# EAGLE design 8iSwitchesOK (EAGLE 6.6.0)
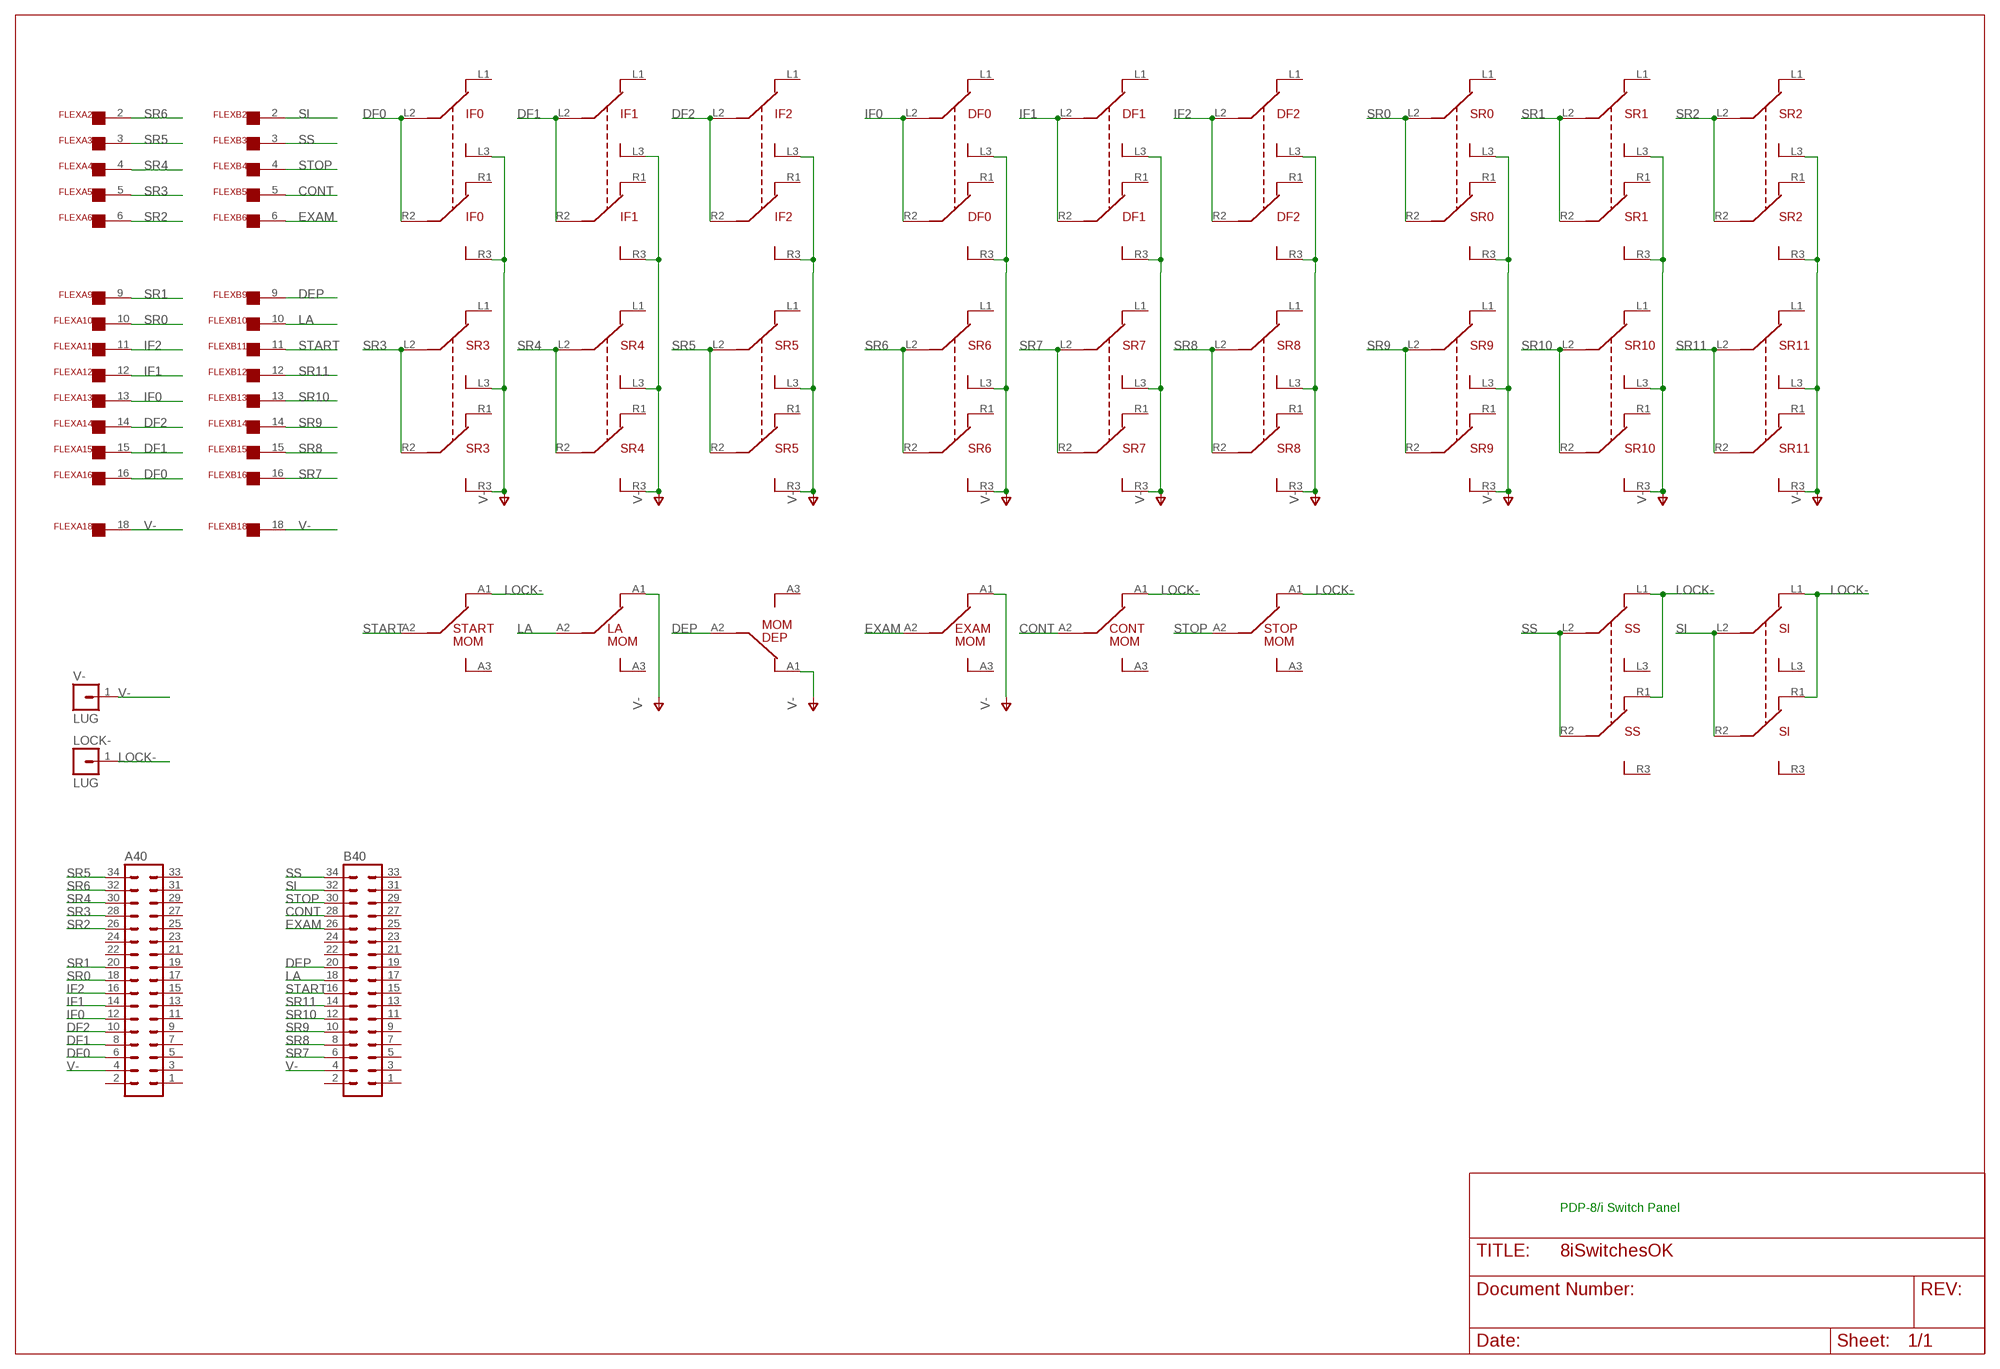
[diagram p0: schematic, sheet 1]

## Parts
A40  MA17-2  [MA17-2]
B40  MA17-2  [MA17-2]
CONT  SPDT8I  [SPDT8I]
DEP  SPDT8I  [SPDT8I]
DF0  DPDT8I  [DPDT8I]
DF1  DPDT8I  [DPDT8I]
DF2  DPDT8I  [DPDT8I]
EXAM  SPDT8I  [SPDT8I]
FLEXA  FLEX19  [FLEX19]
FLEXB  FLEX19  [FLEX19]
IF0  DPDT8I  [DPDT8I]
IF1  DPDT8I  [DPDT8I]
IF2  DPDT8I  [DPDT8I]
LA  SPDT8I  [SPDT8I]
LOCK-  LUG  [SPADELUG]
SI  DPDT8I  [DPDT8I]
SR0  DPDT8I  [DPDT8I]
SR1  DPDT8I  [DPDT8I]
SR2  DPDT8I  [DPDT8I]
SR3  DPDT8I  [DPDT8I]
SR4  DPDT8I  [DPDT8I]
SR5  DPDT8I  [DPDT8I]
SR6  DPDT8I  [DPDT8I]
SR7  DPDT8I  [DPDT8I]
SR8  DPDT8I  [DPDT8I]
SR9  DPDT8I  [DPDT8I]
SR10  DPDT8I  [DPDT8I]
SR11  DPDT8I  [DPDT8I]
SS  DPDT8I  [DPDT8I]
START  SPDT8I  [SPDT8I]
STOP  SPDT8I  [SPDT8I]
V-  LUG  [SPADELUG]

## Nets
CONT: B40.28 CONT.A2 FLEXB.5
DEP: B40.20 DEP.A2 FLEXB.9
DF0: A40.6 FLEXA.16 IF0.L2(A2) IF0.R2(B2)
DF1: A40.8 FLEXA.15 IF1.L2(A2) IF1.R2(B2)
DF2: A40.10 FLEXA.14 IF2.L2(A2) IF2.R2(B2)
EXAM: B40.26 EXAM.A2 FLEXB.6
IF0: A40.12 DF0.L2(A2) DF0.R2(B2) FLEXA.13
IF1: A40.14 DF1.L2(A2) DF1.R2(B2) FLEXA.12
IF2: A40.16 DF2.L2(A2) DF2.R2(B2) FLEXA.11
LA: B40.18 FLEXB.10 LA.A2
LOCK- [supply]: CONT.A1 LOCK-.1 SI.L1(A1) SI.R1(B1) SS.L1(A1) SS.R1(B1) START.A1 STOP.A1
SI: B40.32 FLEXB.2 SI.L2(A2) SI.R2(B2)
SR0: A40.18 FLEXA.10 SR0.L2(A2) SR0.R2(B2)
SR1: A40.20 FLEXA.9 SR1.L2(A2) SR1.R2(B2)
SR2: A40.26 FLEXA.6 SR2.L2(A2) SR2.R2(B2)
SR3: A40.28 FLEXA.5 SR3.L2(A2) SR3.R2(B2)
SR4: A40.30 FLEXA.4 SR4.L2(A2) SR4.R2(B2)
SR5: A40.34 FLEXA.3 SR5.L2(A2) SR5.R2(B2)
SR6: A40.32 FLEXA.2 SR6.L2(A2) SR6.R2(B2)
SR7: B40.6 FLEXB.16 SR7.L2(A2) SR7.R2(B2)
SR8: B40.8 FLEXB.15 SR8.L2(A2) SR8.R2(B2)
SR9: B40.10 FLEXB.14 SR9.L2(A2) SR9.R2(B2)
SR10: B40.12 FLEXB.13 SR10.L2(A2) SR10.R2(B2)
SR11: B40.14 FLEXB.12 SR11.L2(A2) SR11.R2(B2)
SS: B40.34 FLEXB.3 SS.L2(A2) SS.R2(B2)
START: B40.16 FLEXB.11 START.A2
STOP: B40.30 FLEXB.4 STOP.A2
V- [supply]: A40.4 B40.4 DEP.A1 DF0.L3(A3) DF0.R3(B3) DF1.L3(A3) DF1.R3(B3) DF2.L3(A3) DF2.R3(B3) EXAM.A1 FLEXA.18 FLEXB.18 IF0.L3(A3) IF0.R3(B3) IF1.L3(A3) IF1.R3(B3) IF2.L3(A3) IF2.R3(B3) LA.A1 SR0.L3(A3) SR0.R3(B3) SR1.L3(A3) SR1.R3(B3) SR2.L3(A3) SR2.R3(B3) SR3.L3(A3) SR3.R3(B3) SR4.L3(A3) SR4.R3(B3) SR5.L3(A3) SR5.R3(B3) SR6.L3(A3) SR6.R3(B3) SR7.L3(A3) SR7.R3(B3) SR8.L3(A3) SR8.R3(B3) SR9.L3(A3) SR9.R3(B3) SR10.L3(A3) SR10.R3(B3) SR11.L3(A3) SR11.R3(B3) V-.1
Unconnected: A40.1 A40.2 A40.3 A40.5 A40.7 A40.9 A40.11 A40.13 A40.15 A40.17 A40.19 A40.21 A40.22 A40.23 A40.24 A40.25 A40.27 A40.29 A40.31 A40.33 B40.1 B40.2 B40.3 B40.5 B40.7 B40.9 B40.11 B40.13 B40.15 B40.17 B40.19 B40.21 B40.22 B40.23 B40.24 B40.25 B40.27 B40.29 B40.31 B40.33 CONT.A3 DEP.A3 DF0.L1(A1) DF0.R1(B1) DF1.L1(A1) DF1.R1(B1) DF2.L1(A1) DF2.R1(B1) EXAM.A3 FLEXA.1 FLEXA.7 FLEXA.8 FLEXA.17 FLEXA.19 FLEXB.1 FLEXB.7 FLEXB.8 FLEXB.17 FLEXB.19 IF0.L1(A1) IF0.R1(B1) IF1.L1(A1) IF1.R1(B1) IF2.L1(A1) IF2.R1(B1) LA.A3 SI.L3(A3) SI.R3(B3) SR0.L1(A1) SR0.R1(B1) SR1.L1(A1) SR1.R1(B1) SR2.L1(A1) SR2.R1(B1) SR3.L1(A1) SR3.R1(B1) SR4.L1(A1) SR4.R1(B1) SR5.L1(A1) SR5.R1(B1) SR6.L1(A1) SR6.R1(B1) SR7.L1(A1) SR7.R1(B1) SR8.L1(A1) SR8.R1(B1) SR9.L1(A1) SR9.R1(B1) SR10.L1(A1) SR10.R1(B1) SR11.L1(A1) SR11.R1(B1) SS.L3(A3) SS.R3(B3) START.A3 STOP.A3

## Notes on the sheet
- PDP-8/i Switch Panel

## Library data of the parts
A40 B40 = con-lstb:MA17-2: PIN HEADER; OC_FARNELL: unknown; OC_NEWARK: unknown
CONT DEP EXAM LA START STOP = dec-con:SPDT8I: SPDT Momentary, as used in 8/i.
DF0 DF1 DF2 IF0 IF1 IF2 SI SR0 SR1-SR11 SS = dec-con:DPDT8I: DPDT switch as used in 8/i.
FLEXA FLEXB = dec-con:FLEX19: 19 pin Flexprint Connection
LOCK- V- = dec-con:LUG: Spade Lug

## Net classes
1 supply: width 0.762 mm

## Board
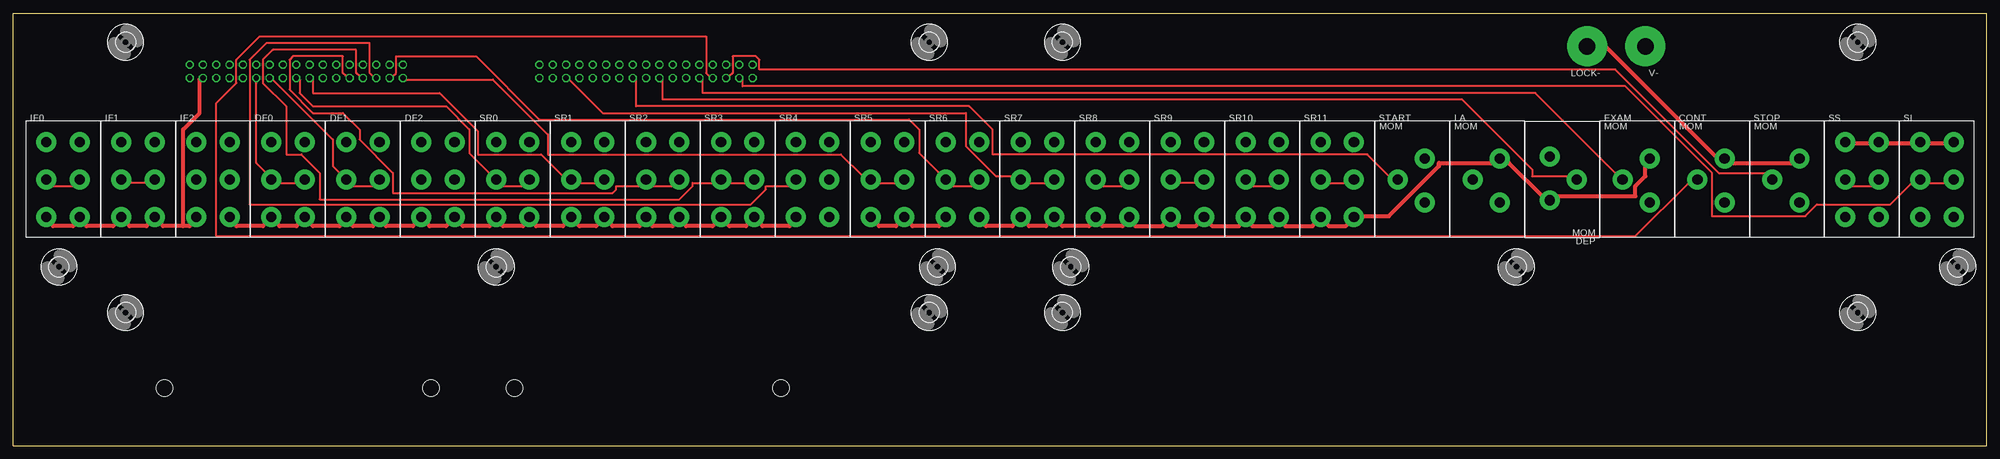
[diagram p1: board, top side]
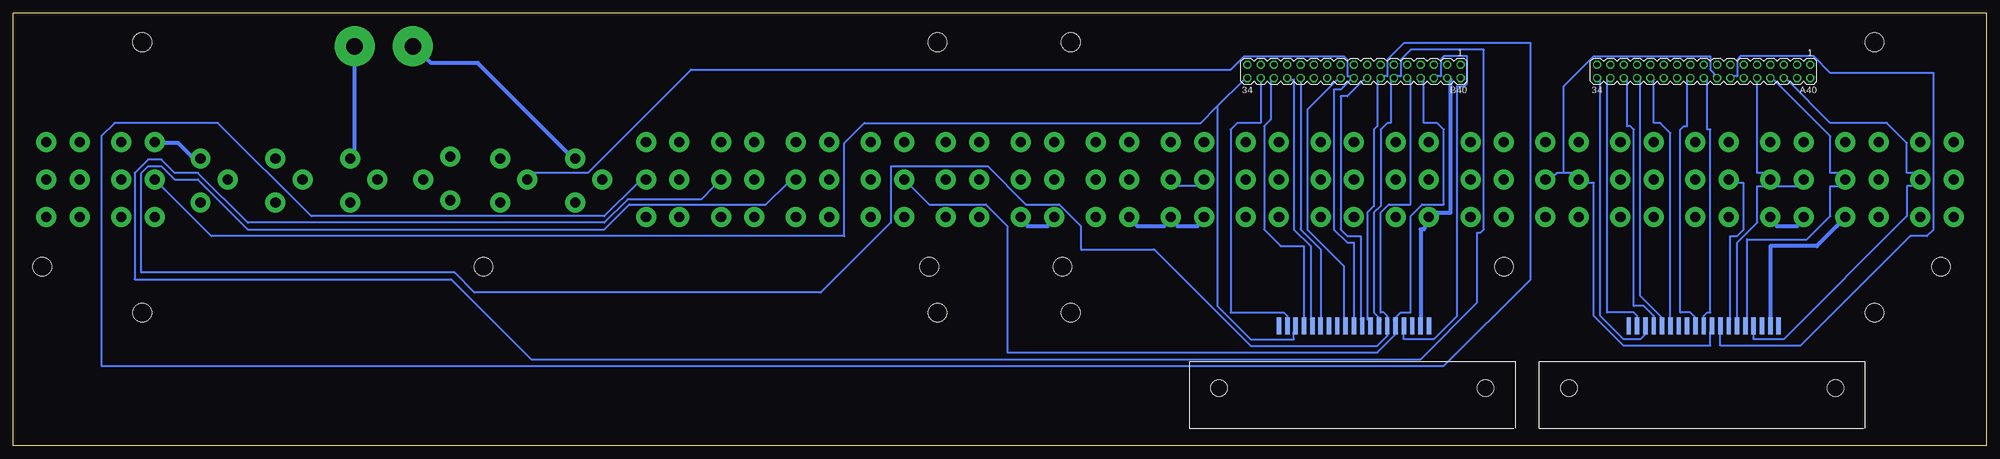
[diagram p2: board, bottom side, seen from below]

Size 376.24 x 82.55 mm. Coordinates in mm from the lower left corner, seen from the top.
Outline: 0,0 101.6,0 376.24,0 376.24,82.55 0,82.55 0,0
Copper layers (1*16): Top 0.035mm / dielectric 1.5mm / Bottom 0.035mm
Design rules "15mils": minimum track width 15mil, minimum drill 24mil, track to track 15mil, track to pad 10mil, pad to pad 10mil, via to via 10mil, smd to smd 10mil, copper to edge 25mil, drill to drill 10mil, minimum pad ring 10mil, minimum via ring 8mil, stop-mask expansion 0mil, vias tented up to drill 0mil, thermal gap 10mil

### Footprints (pad centres in the part's own frame; a part is rotated, then mirrored left to right if it is on the bottom)
MA17-2 = drill 1.016 octagon: 1 -20.32,-1.27; 2 -20.32,1.27; 3 -17.78,-1.27; 4 -17.78,1.27; 5 -15.24,-1.27; 6 -15.24,1.27; 7 -12.7,-1.27; 8 -12.7,1.27; 9 -10.16,-1.27; 10 -10.16,1.27; 11 -7.62,-1.27; 12 -7.62,1.27; 13 -5.08,-1.27; 14 -5.08,1.27; 15 -2.54,-1.27; 16 -2.54,1.27; 17 0,-1.27; 18 0,1.27; 19 2.54,-1.27; 20 2.54,1.27; 21 5.08,-1.27; 22 5.08,1.27; 23 7.62,-1.27; 24 7.62,1.27; 25 10.16,-1.27; 26 10.16,1.27; 27 12.7,-1.27; 28 12.7,1.27; 29 15.24,-1.27; 30 15.24,1.27; 31 17.78,-1.27; 32 17.78,1.27; 33 20.32,-1.27; 34 20.32,1.27
SPDT8I = drill 1.93 pad 3.81: A1 2.381,3.969; A2 -2.778,0; A3 2.381,-4.366
DPDT8I = drill 1.93 pad 3.81: L1 -3.175,7.144; L2 -3.175,0; L3 -3.175,-7.144; R1 3.175,7.144; R2 3.175,0; R3 3.175,-7.144
FLEX19 = smd 3.175 x 0.838: 1 0,14.287; 2 0,12.7; 3 0,11.113; 4 0,9.525; 5 0,7.938; 6 0,6.35; 7 0,4.763; 8 0,3.175; 9 0,1.587; 10 0,0; 11 0,-1.587; 12 0,-3.175; 13 0,-4.763; 14 0,-6.35; 15 0,-7.938; 16 0,-9.525; 17 0,-11.113; 18 0,-12.7; 19 0,-14.287
SPADELUG = drill 3.175 pad 7.62: 1 0,0
3,6 = hole 3.6: 0,0
STRAIN-RELIEF = hole 3.175: 7.62,56.515; 7.62,5.715

### Placement (x,y rotation side)
A40  53.98,71.44 180 bottom
B40  120.65,71.44 180 bottom
CONT  323.85,50.8 0 top
DEP  295.27,50.8 180 top
DF0  52.39,50.8 0 top
DF1  66.67,50.8 0 top
DF2  80.96,50.8 0 top
EXAM  309.56,50.8 0 top
FLEXA  53.98,22.86 90 bottom
FLEXB  120.65,22.86 90 bottom
IF0  9.53,50.8 0 top
IF1  23.81,50.8 0 top
IF2  38.1,50.8 0 top
LA  280.99,50.8 0 top
LOCK-  300.04,76.2 180 top
SI  366.71,50.8 0 top
SR0  95.25,50.8 0 top
SR1  109.54,50.8 0 top
SR2  123.83,50.8 0 top
SR3  138.11,50.8 0 top
SR4  152.4,50.8 0 top
SR5  166.69,50.8 0 top
SR6  180.97,50.8 0 top
SR7  195.26,50.8 0 top
SR8  209.55,50.8 0 top
SR9  223.84,50.8 0 top
SR10  238.12,50.8 0 top
SR11  252.41,50.8 0 top
SS  352.43,50.8 0 top
START  266.7,50.8 0 top
STOP  338.14,50.8 0 top
U$1  [3,6]  201.61,34.13 0 top
U$2  [3,6]  200.03,25.4 0 top
U$3  [3,6]  286.54,34.13 0 top
U$4  [3,6]  200.03,76.99 0 top
U$5  [3,6]  351.63,76.99 0 top
U$6  [3,6]  370.68,34.13 0 top
U$7  [3,6]  351.63,25.4 0 top
U$10  [3,6]  176.21,34.13 0 top
U$11  [3,6]  174.62,25.4 0 top
U$12  [3,6]  174.62,76.99 0 top
U$13  [3,6]  21.43,76.99 0 top
U$14  [3,6]  21.43,25.4 0 top
U$15  [3,6]  8.73,34.13 0 top
U$16  [3,6]  92.08,34.13 0 top
U$17  [STRAIN-RELIEF]  89.85,3.33 90 bottom
U$18  [STRAIN-RELIEF]  23.18,3.33 90 bottom
V-  311.15,76.2 180 top

### Tracks (layer width: path | path; a pad name or v marks a point on that pad's centre or on a via)
CONT
  Top 0.381: CONT.A2 319.4,50.16 309.25,40.01 38.73,40.01 38.73,65.41 42.55,69.22 42.55,73.66 46.99,78.11 132.08,78.11 132.08,71.12 132.72,70.48 B40.28
  Bottom 0.381: FLEXB.5 128.91,24.13 128.91,38.1 132.08,41.27 132.08,69.85 132.72,69.85 B40.28
DEP
  Top 0.381: DEP.A2 296.55,51.44 289.56,51.44 289.56,52.7 276.23,66.04 123.83,66.04 123.83,69.85 B40.20
  Bottom 0.381: B40.20 123.83,69.85 129.54,64.14 129.54,41.27 122.56,34.29 122.56,24.13 FLEXB.9
DF0
  Top 0.381: IF0.L2 7.62,49.53 11.43,49.53 IF0.R2
  Bottom 0.381: A40.6 38.1,69.85 29.84,61.59 19.05,61.59 15.24,57.78 15.24,52.07 13.97,52.07 IF0.R2 13.97,49.53 15.24,49.53 15.24,43.81 38.73,20.32 44.45,20.32 44.45,21.59 FLEXA.16
DF1
  Top 0.381: IF1.L2 22.23,50.16 25.4,50.16 IF1.R2
  Bottom 0.381: A40.8 40.64,69.85 29.84,59.05 29.84,52.07 27.94,52.07 IF1.R2 27.94,49.53 29.84,49.53 29.84,43.81 34.29,39.37 45.72,39.37 45.72,24.13 FLEXA.15
DF2
  Bottom 0.381: A40.10 43.81,69.85 43.81,52.07 42.55,52.07 IF2.R2 | FLEXA.14 47.62,24.13 47.62,38.73 43.81,42.55 43.81,49.53 42.55,49.53 IF2.R2 | IF2.L2 36.2,49.53 40.01,49.53 IF2.R2
EXAM
  Top 0.381: EXAM.A2 305.44,52.07 290.19,67.31 131.44,67.31 131.44,69.85 B40.26
  Bottom 0.381: FLEXB.6 127,24.13 127,37.47 130.81,41.27 130.81,69.85 B40.26
IF0
  Top 0.381: A40.12 46.35,69.85 46.35,53.98 48.26,52.07 DF0.L2 50.8,50.16 53.98,50.16 DF0.R2
  Bottom 0.381: FLEXA.13 48.9,24.13 48.9,40.01 47.62,40.01 46.35,41.27 46.35,50.16 47.62,50.16 DF0.L2
IF1
  Top 0.381: A40.14 49.53,69.85 60.96,58.42 60.96,53.34 62.23,52.07 DF1.L2 64.77,49.53 68.58,49.53 DF1.R2
  Bottom 0.381: FLEXA.12 50.8,21.59 50.8,19.05 35.56,19.05 14.61,40.01 11.43,40.01 10.16,41.27 10.16,71.12 29.84,71.12 33.02,74.3 46.99,74.3 47.62,73.66 47.62,70.48 48.26,70.48 A40.14
IF2
  Bottom 0.381: 80.64,52.07 80.64,68.58 74.93,74.3 52.7,74.3 52.7,71.75 52.07,71.12 52.07,70.48 A40.16 | 80.64,52.07 78.74,52.07 DF2.L2 76.2,50.16 74.93,50.16 74.93,24.77 69.22,19.05 52.7,19.05 52.7,21.59 FLEXA.11 | 80.64,52.07 81.92,52.07 82.55,51.44 DF2.R2
LA
  Bottom 0.381: FLEXB.10 120.65,24.13 120.65,38.73 121.92,38.73 124.46,41.27 124.46,67.94 123.19,67.94 121.28,69.85 B40.18 121.28,70.48 121.92,70.48 121.92,73.66 122.56,74.3 141.6,74.3 144.15,71.75 247.01,71.75 266.7,52.07 276.86,52.07 LA.A2
LOCK-
  Top 0.762: STOP.A1 339.09,53.98 327.66,53.98 CONT.A1 324.49,55.24 303.53,76.2 LOCK-.1 | SS.L1 350.52,57.78 354.33,57.78 SS.R1 356.87,57.78 361.95,57.78 SI.L1 365.12,57.78 368.3,57.78 SI.R1
  Bottom 0.762: STOP.A1 342.26,55.24 344.81,57.78 347.98,57.78 SS.L1 | START.A1 270.51,55.88 287.65,73.03 296.55,73.03 LOCK-.1
SI
  Top 0.381: SI.R2 368.3,50.16 365.12,50.16 SI.L2 361.95,50.16 357.82,46.04 343.85,46.04 342.9,45.09 341.63,43.81 323.85,43.81 323.85,52.07 307.34,68.58 139.06,68.58 139.06,69.85 B40.32
  Bottom 0.381: B40.32 138.43,69.85 138.43,61.59 142.88,61.59 144.15,60.33 144.15,25.4 133.99,25.4 133.35,24.77 133.35,24.13 FLEXB.2
SR0
  Top 0.381: SR0.R2 97.16,49.53 93.34,49.53 SR0.L2 90.81,52.07 87,55.88 87,60.33 82.55,64.77 57.15,64.77 54.61,67.31 54.61,69.85 A40.18
  Bottom 0.381: A40.18 53.34,69.85 53.34,60.33 52.7,60.33 52.7,25.4 53.34,25.4 53.98,24.77 53.98,24.13 FLEXA.10
SR1
  Top 0.381: SR1.R2 111.12,50.16 107.95,50.16 SR1.L2 104.78,51.44 100.65,55.56 88.58,55.56 88.58,60.01 81.28,67.31 57.15,67.31 57.15,69.85 A40.20
  Bottom 0.381: A40.20 57.15,69.85 57.15,60.96 57.78,60.96 58.42,60.33 58.42,25.4 56.52,25.4 55.24,24.13 FLEXA.9
SR2
  Top 0.381: SR2.R2 125.73,49.53 121.92,49.53 SR2.L2 119.38,49.53 114.94,49.53 114.94,48.9 114.3,48.26 72.39,48.26 72.39,52.07 66.04,58.42 66.04,60.33 62.87,63.5 57.15,63.5 52.7,67.94 52.7,73.66 53.34,74.3 62.87,74.3 62.87,71.12 63.5,70.48 A40.26
  Bottom 0.381: A40.26 63.5,69.85 63.5,61.59 62.23,61.59 60.33,59.69 60.33,24.13 FLEXA.6
SR3
  Top 0.381: SR3.R2 139.7,50.16 136.53,50.16 SR3.L2 133.35,50.16 129.54,50.16 129.54,49.53 127,46.99 58.42,46.99 58.42,52.07 54.93,55.56 52.07,55.56 52.07,64.77 47.62,69.22 47.62,73.66 49.53,75.56 65.41,75.56 65.41,71.12 66.04,70.48 A40.28
  Bottom 0.381: A40.28 66.04,69.85 66.04,28.57 61.59,24.13 FLEXA.5
SR4
  Top 0.381: SR4.L2 147.96,49.53 143.51,49.53 143.51,48.9 140.65,46.04 45.09,46.04 45.09,73.66 48.26,76.83 67.94,76.83 67.94,71.12 68.58,70.48 A40.30
  Bottom 0.381: SR4.L2 150.5,49.53 154.31,49.53 SR4.R2 | A40.30 68.58,69.85 68.58,60.96 67.94,60.96 67.31,60.33 67.31,26.67 65.41,26.67 63.5,24.77 63.5,24.13 FLEXA.4
SR5
  Top 0.381: SR5.R2 168.28,50.16 165.1,50.16 SR5.L2 161.93,51.44 157.8,55.56 101.92,55.56 101.92,59.37 91.44,69.85 74.93,69.85 A40.34
  Bottom 0.381: A40.34 73.66,69.85 73.66,24.77 69.22,20.32 66.04,20.32 64.77,21.59 FLEXA.3
SR6
  Top 0.381: SR6.R2 182.88,49.53 179.07,49.53 SR6.L2 176.53,52.07 172.72,55.88 172.72,60.33 170.81,62.23 100.33,62.23 88.27,74.3 73.03,74.3 73.03,71.12 72.39,70.48 A40.32
  Bottom 0.381: A40.32 72.39,69.85 72.39,25.4 67.31,25.4 66.67,24.77 66.67,24.13 FLEXA.2
SR7
  Top 0.381: SR7.R2 196.85,50.16 193.68,50.16 SR7.L2 190.5,51.44 187.32,51.44 181.61,57.15 181.61,63.5 112.39,63.5 106.05,69.85 B40.6
  Bottom 0.381: FLEXB.16 111.12,21.59 111.12,20.32 105.41,20.32 100.97,24.77 100.97,68.58 99.69,68.58 99.06,69.22 99.06,74.3 103.5,74.3 104.14,73.66 104.14,70.48 104.78,70.48 B40.6
SR8
  Top 0.381: SR8.L2 207.65,49.53 211.46,49.53 SR8.R2
  Bottom 0.381: B40.8 107.31,69.85 107.31,61.59 104.78,61.59 103.5,60.33 103.5,46.04 107.63,46.04 109.86,43.81 109.86,25.4 111.76,25.4 113.03,24.13 FLEXB.15 112.39,21.59 116.2,17.78 186.69,17.78 186.69,41.91 190.82,46.04 201.61,46.04 205.1,49.53 SR8.L2
SR9
  Top 0.381: SR9.L2 222.25,50.16 225.43,50.16 SR9.R2
  Bottom 0.381: B40.10 109.86,69.85 109.86,46.04 113.98,46.04 115.57,44.45 115.57,25.4 114.94,25.4 114.3,24.77 114.3,24.13 FLEXB.14 114.3,21.59 114.3,20.95 116.2,19.05 140.34,19.05 158.75,37.47 172.72,37.47 172.72,41.91 176.85,46.04 183.2,46.04 190.5,53.34 208.91,53.34 208.91,42.55 222.25,29.21 288.29,29.21 292.1,33.02 351.79,33.02 351.79,52.07 350.52,53.34 347.98,53.34 345.44,50.8 341,50.8 331.47,41.27 263.52,41.27 258.76,46.04 232.73,46.04 228.6,50.16 SR9.R2
SR10
  Top 0.381: SR10.L2 236.22,49.53 240.03,49.53 SR10.R2
  Bottom 0.381: FLEXB.13 115.57,24.13 116.84,25.4 116.84,44.45 115.57,45.72 115.57,60.33 114.3,61.59 113.67,61.59 113.67,69.85 B40.12 112.39,70.48 111.76,70.48 111.76,73.66 109.86,75.56 95.89,75.56 95.89,41.27 96.52,40.64 97.16,40.64 97.16,27.3 107.95,16.51 277.5,16.51 292.74,31.75 353.06,31.75 353.06,52.07 350.52,54.61 347.98,54.61 345.44,52.07 341,52.07 331.47,42.55 263.52,42.55 259.08,46.99 245.11,46.99 242.57,49.53 SR10.R2
SR11
  Top 0.381: SR11.L2 250.82,50.16 254,50.16 SR11.R2
  Bottom 0.381: FLEXB.12 117.47,24.13 118.11,24.13 118.11,44.45 116.84,45.72 116.84,60.33 116.2,60.96 116.2,69.85 B40.14 114.94,70.48 114.3,70.48 114.3,73.66 111.12,76.83 87,76.83 87,31.75 103.5,15.24 359.41,15.24 359.41,59.05 356.87,61.59 337.19,61.59 319.4,43.81 263.52,43.81 257.18,50.16 SR11.R2
SS
  Top 0.381: SS.R2 354.33,49.53 350.52,49.53 SS.L2
  Bottom 0.381: 146.69,64.77 149.86,61.59 214,61.59 217.81,57.78 217.81,40.01 338.45,40.01 347.98,49.53 SS.L2 | 146.69,64.77 141.6,69.85 B40.34 | 146.69,64.77 146.69,26.67 140.34,20.32 132.08,20.32 132.08,21.59 FLEXB.3
START
  Top 0.381: START.A2 262.25,51.44 258.13,55.56 186.69,55.56 186.69,60.33 182.25,64.77 118.75,64.77 118.75,69.85 B40.16
  Bottom 0.381: FLEXB.11 119.38,24.13 119.38,40.01 121.92,40.01 123.19,41.27 123.19,66.67 121.92,66.67 118.75,69.85 B40.16
STOP
  Top 0.381: STOP.A2 334.01,52.07 325.12,52.07 305.44,71.75 142.24,71.75 142.24,73.66 141.6,74.3 137.16,74.3 137.16,71.12 136.53,70.48 B40.30
  Bottom 0.381: FLEXB.4 130.18,24.13 130.18,38.1 134.62,38.1 137.79,41.27 137.79,60.96 136.53,62.23 136.53,69.85 B40.30
V-
  Top 0.762: EXAM.A1 311.15,53.34 311.15,51.44 309.25,49.53 309.25,47.62 294.64,47.62 DEP.A1 291.46,47.62 285.12,53.98 LA.A1 281.94,53.98 271.78,53.98 271.78,53.34 262.25,43.81 257.18,43.81 SR11.R3 254,41.91 250.82,41.91 SR11.L3 247.65,41.91 242.57,41.91 SR10.R3 240.03,41.91 236.22,41.91 SR10.L3 233.68,41.91 228.6,41.91 SR9.R3 225.43,41.91 222.25,41.91 SR9.L3 219.07,41.91 214,41.91 SR8.R3 211.46,41.91 207.65,41.91 SR8.L3 205.1,41.91 200.03,41.91 SR7.R3 196.85,41.91 193.68,41.91 SR7.L3 190.5,41.91 185.42,41.91 SR6.R3 | IF0.L3 7.62,41.91 11.43,41.91 IF0.R3 13.97,41.91 19.05,41.91 IF1.L3 22.23,41.91 25.4,41.91 IF1.R3 28.57,41.91 32.38,41.91 | IF2.R3 42.55,41.91 47.62,41.91 DF0.L3 50.8,41.91 53.98,41.91 DF0.R3 57.15,41.91 62.23,41.91 DF1.L3 64.77,41.91 68.58,41.91 DF1.R3 71.12,41.91 76.2,41.91 DF2.L3 79.38,41.91 82.55,41.91 DF2.R3 85.72,41.91 90.81,41.91 SR0.L3 93.34,41.91 97.16,41.91 SR0.R3 99.69,41.91 104.78,41.91 SR1.L3 107.95,41.91 111.12,41.91 SR1.R3 114.3,41.91 119.38,41.91 SR2.L3 121.92,41.91 125.73,41.91 SR2.R3 128.27,41.91 133.35,41.91 SR3.L3 136.53,41.91 139.7,41.91 SR3.R3 142.88,41.91 147.96,41.91 SR4.L3 | SR5.L3 165.1,41.91 168.28,41.91 SR5.R3 171.45,41.91 176.53,41.91 SR6.L3 | 32.38,41.91 33.66,41.91 IF2.L3 | 32.38,41.91 32.38,60.33 35.56,63.5 35.56,69.85 A40.4
  Bottom 0.762: SR6.L3 179.07,41.91 182.88,41.91 SR6.R3 | SR4.L3 150.5,41.91 154.31,41.91 SR4.R3 156.84,41.91 161.93,41.91 SR5.L3 | IF2.R3 40.01,41.91 36.2,41.91 IF2.L3 | FLEXA.18 41.27,24.13 41.27,38.1 32.38,38.1 28.57,41.91 IF1.R3 | V-.1 311.15,73.03 311.15,56.52 EXAM.A1 | FLEXB.18 107.95,24.13 107.95,41.27 107.31,41.27 SR1.L3 105.41,44.45 102.23,44.45 102.23,69.85 B40.4